# Altium project DisplaySolderStation.PrjPcb
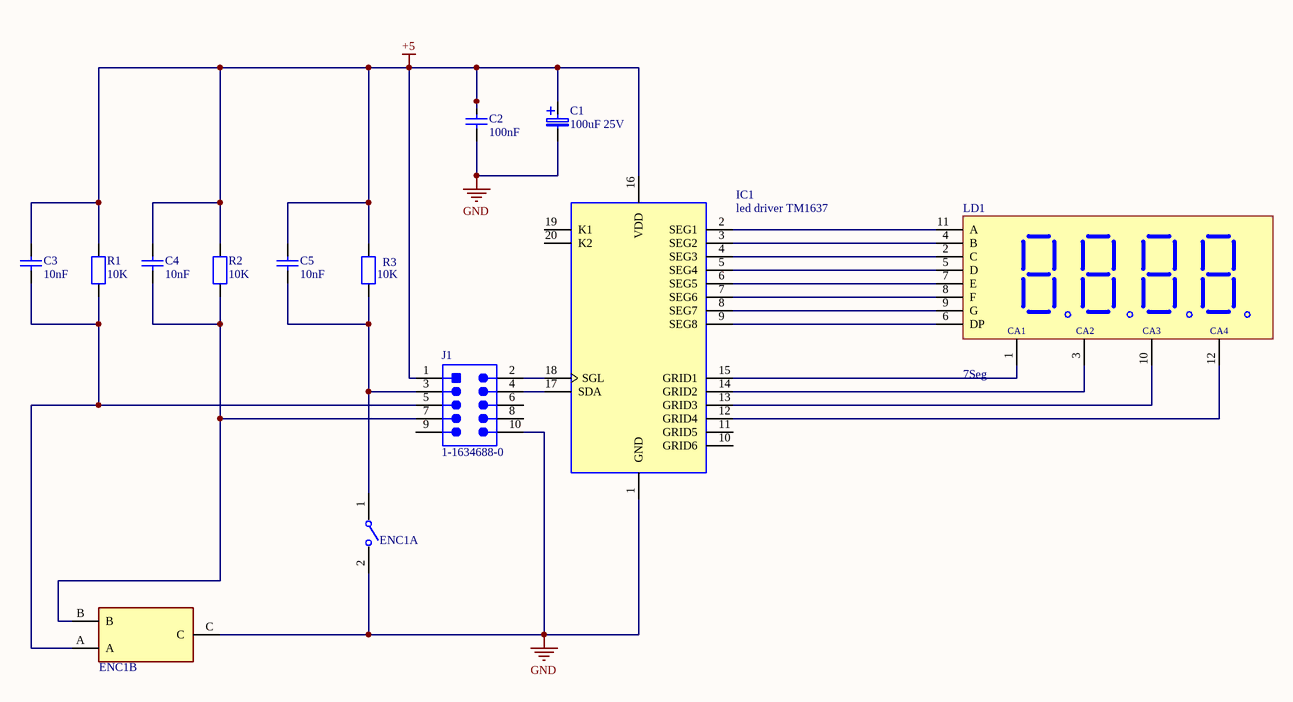
[diagram p0: Display.SchDoc]
1 sheet, 12 parts. Net scope: global (net labels, ports and power ports of the same name join across sheets).
Board file: Display.PcbDoc

## Sheet Display.SchDoc
size A4; SheetNumber: 1; SheetTotal: 1

### Parts
C1  100uF 25V  [TAP106M050BRW]
C2  100nF  [CAPC2012X88N]
C3  10nF  [CAPC2012X88N]
C4  10nF  [CAPC2012X88N]
C5  10nF  [CAPC2012X88N]
ENC1  PEC11R-4220F-S0012  [PEC11R_4220F_S0012]  (value not drawn)  (parts A,B of 2)
IC1  led driver TM1637  [N-20]
J1  1-1634688-0  [TECO-1-1634688-0-10_V]
LD1  7Seg  [KW4-801AVB/KW4-801CVB]
R1  10K  [RESC2012X50N]
R2  10K  [RESC2012X50N]
R3  10K  [RESC2012X50N]

### Nets
+5: C1.1 C2.2 C3.2 C4.2 C5.2 IC1.16(VDD) J1.1 R1.2 R2.2 R3.2
GND: C1.2 C2.1 ENC1.2 ENC1.C IC1.1(GND) J1.10
NetC3_1: C3.1 ENC1.A J1.5 R1.1
NetC4_1: C4.1 ENC1.B J1.7 R2.1
NetC5_1: C5.1 ENC1.1 J1.3 R3.1
NetIC1_2: IC1.2(SEG1) LD1.11(A)
NetIC1_3: IC1.3(SEG2) LD1.4(B)
NetIC1_4: IC1.4(SEG3) LD1.2(C)
NetIC1_5: IC1.5(SEG4) LD1.5(D)
NetIC1_6: IC1.6(SEG5) LD1.7(E)
NetIC1_7: IC1.7(SEG6) LD1.8(F)
NetIC1_8: IC1.8(SEG7) LD1.9(G)
NetIC1_9: IC1.9(SEG8) LD1.6(DP)
NetIC1_12: IC1.12(GRID4) LD1.12
NetIC1_13: IC1.13(GRID3) LD1.10
NetIC1_14: IC1.14(GRID2) LD1.3
NetIC1_15: IC1.15(GRID1) LD1.1(CA1)
NetIC1_17: IC1.17(SDA) J1.4
NetIC1_18: IC1.18(SGL) J1.2

Not connected (* = marked no-connect by the designer): IC1 10(GRID6) 11(GRID5) 19(K1) 20(K2); J1 6 8 9

### Notes on the sheet
- (in symbol Display LED 4-Digit) CA2; CA3; CA4

### Library data of the parts
C1 = capacitor THT radial tantalum: Tantalum Capacitors - Solid Leaded 50V 10uF 20% ESR=1.6 Ohm TAP106M050BRW; Manufacturer_Name: Kyocera AVX; Geometry.Height: 15.5mm; Mouser Part Number: 581-TAP106M050BRW; Mouser Price/Stock: https://www.mouser.co.uk/ProductDetail/AVX/TAP106M050BRW?qs=GjEaAqXp9rZGx11KfVU76g%3D%3D; Manufacturer_Part_Number: TAP106M050BRW; Datasheet Link: https://www.mouser.be/datasheet/2/40/tap-776819.pdf
C2-C5 = Capacitor ceramic 0805: Manufacturer: Kemet; Part Number: C0402C104K4RACTU
ENC1 = RotEncoderButtom: ROTARY ENCODER MECHANICAL 12PPR PEC11R-4220F-S0012; Built in Switch: Yes; Number of Channels: 2; Output Type: Quadrature; Hole Diameter: 7mm; Pulses per Revolution: 12; Termination: PC Pin; Package Quantity: 150; RoHS Compliant: Yes; Mount: Through Hole; Width: 12.5mm; Radiation Hardening: No; Number of Pins: 5; REACH SVHC: No SVHC; Type: Mechanical; Packaging: Bulk; Min Operating Temperature: -30°C; Encoder Type: Mechanical; Height: 13.4mm; Length: 26.5mm; Orientation: Vertical; Max Operating Temperature: 70°C; Series: PEC11R; Detent: Yes
IC1 = led driver TM1637: LED Drive Control Special Circuit; MF: Titan Micro Electronics; Package: Package; Availability: Not in stock; SnapEDA_Link: https://www.snapeda.com/parts/TM1637/Titan+Micro+Electronics/view-part/?ref=snap; MP: TM1637; Check_prices: https://www.snapeda.com/parts/TM1637/Titan+Micro+Electronics/view-part/?ref=eda; Value: *; Price: None
J1 = pin header 2X5 10pins: CMP-2000-05854-1 Male Header, Pitch 2.54 mm, 2 x 5 Postion, Height 9.15 mm, Tail Length 3.2 mm, -40 to 105 degC, RoHS, Bulk; Manufacturer: TE Connectivity; No. of Rows: 2; SVHC: ToBeAdvised; Package Version: Rev. C2, 02/2011; No. of Contacts: 10Contacts; Pitch: 2.54mm; No. of Positions: 10; Contact Termination Type: ThroughHole; Package Description: 10-Pin Connector, Body 20.35 x 8.7 mm, Pitch 2.54 mm; Orientation: Straight; Gender: Header; Mounting Technology: ThroughHole; Product Range: -; PartNumber: 1-1634688-0; Datasheet Version: Rev. C2, 02/2011; Contact Material: Brass; Package URL: https://datasheet.ciiva.com/6831/eng-cd-1634688-c2-6831201.pdf; Package Reference: 1-1634688-0; Pitch Spacing: 2.54mm; Contact Plating: GoldPlatedContacts; Manufacturer URL: http://www.te.com/; Datasheet URL: https://datasheet.ciiva.com/6831/eng-cd-1634688-c2-6831201.pdf
LD1 = Display LED 4-Digit: 4-Digit LED Display TME KW4-801AVB
R1-R3 = resistor 0805: Manufacturer: Vishay Dale; Part Number: CRCW08050000Z0EA